# EasyEDA Pro project ProPrj_嵌赛国赛_2025-08-15.epro, schematic Schematic2

## Sheets
1 P1: Board Name: 药箱主控板; Create Date: 2025-07-22; Page Name: P1; Project Name: 嵌赛国赛; Schematic Name: Schematic2; Update Date: 2025-07-22; Company: 嘉立创EDA; Page Size: A4; Version: V1.0
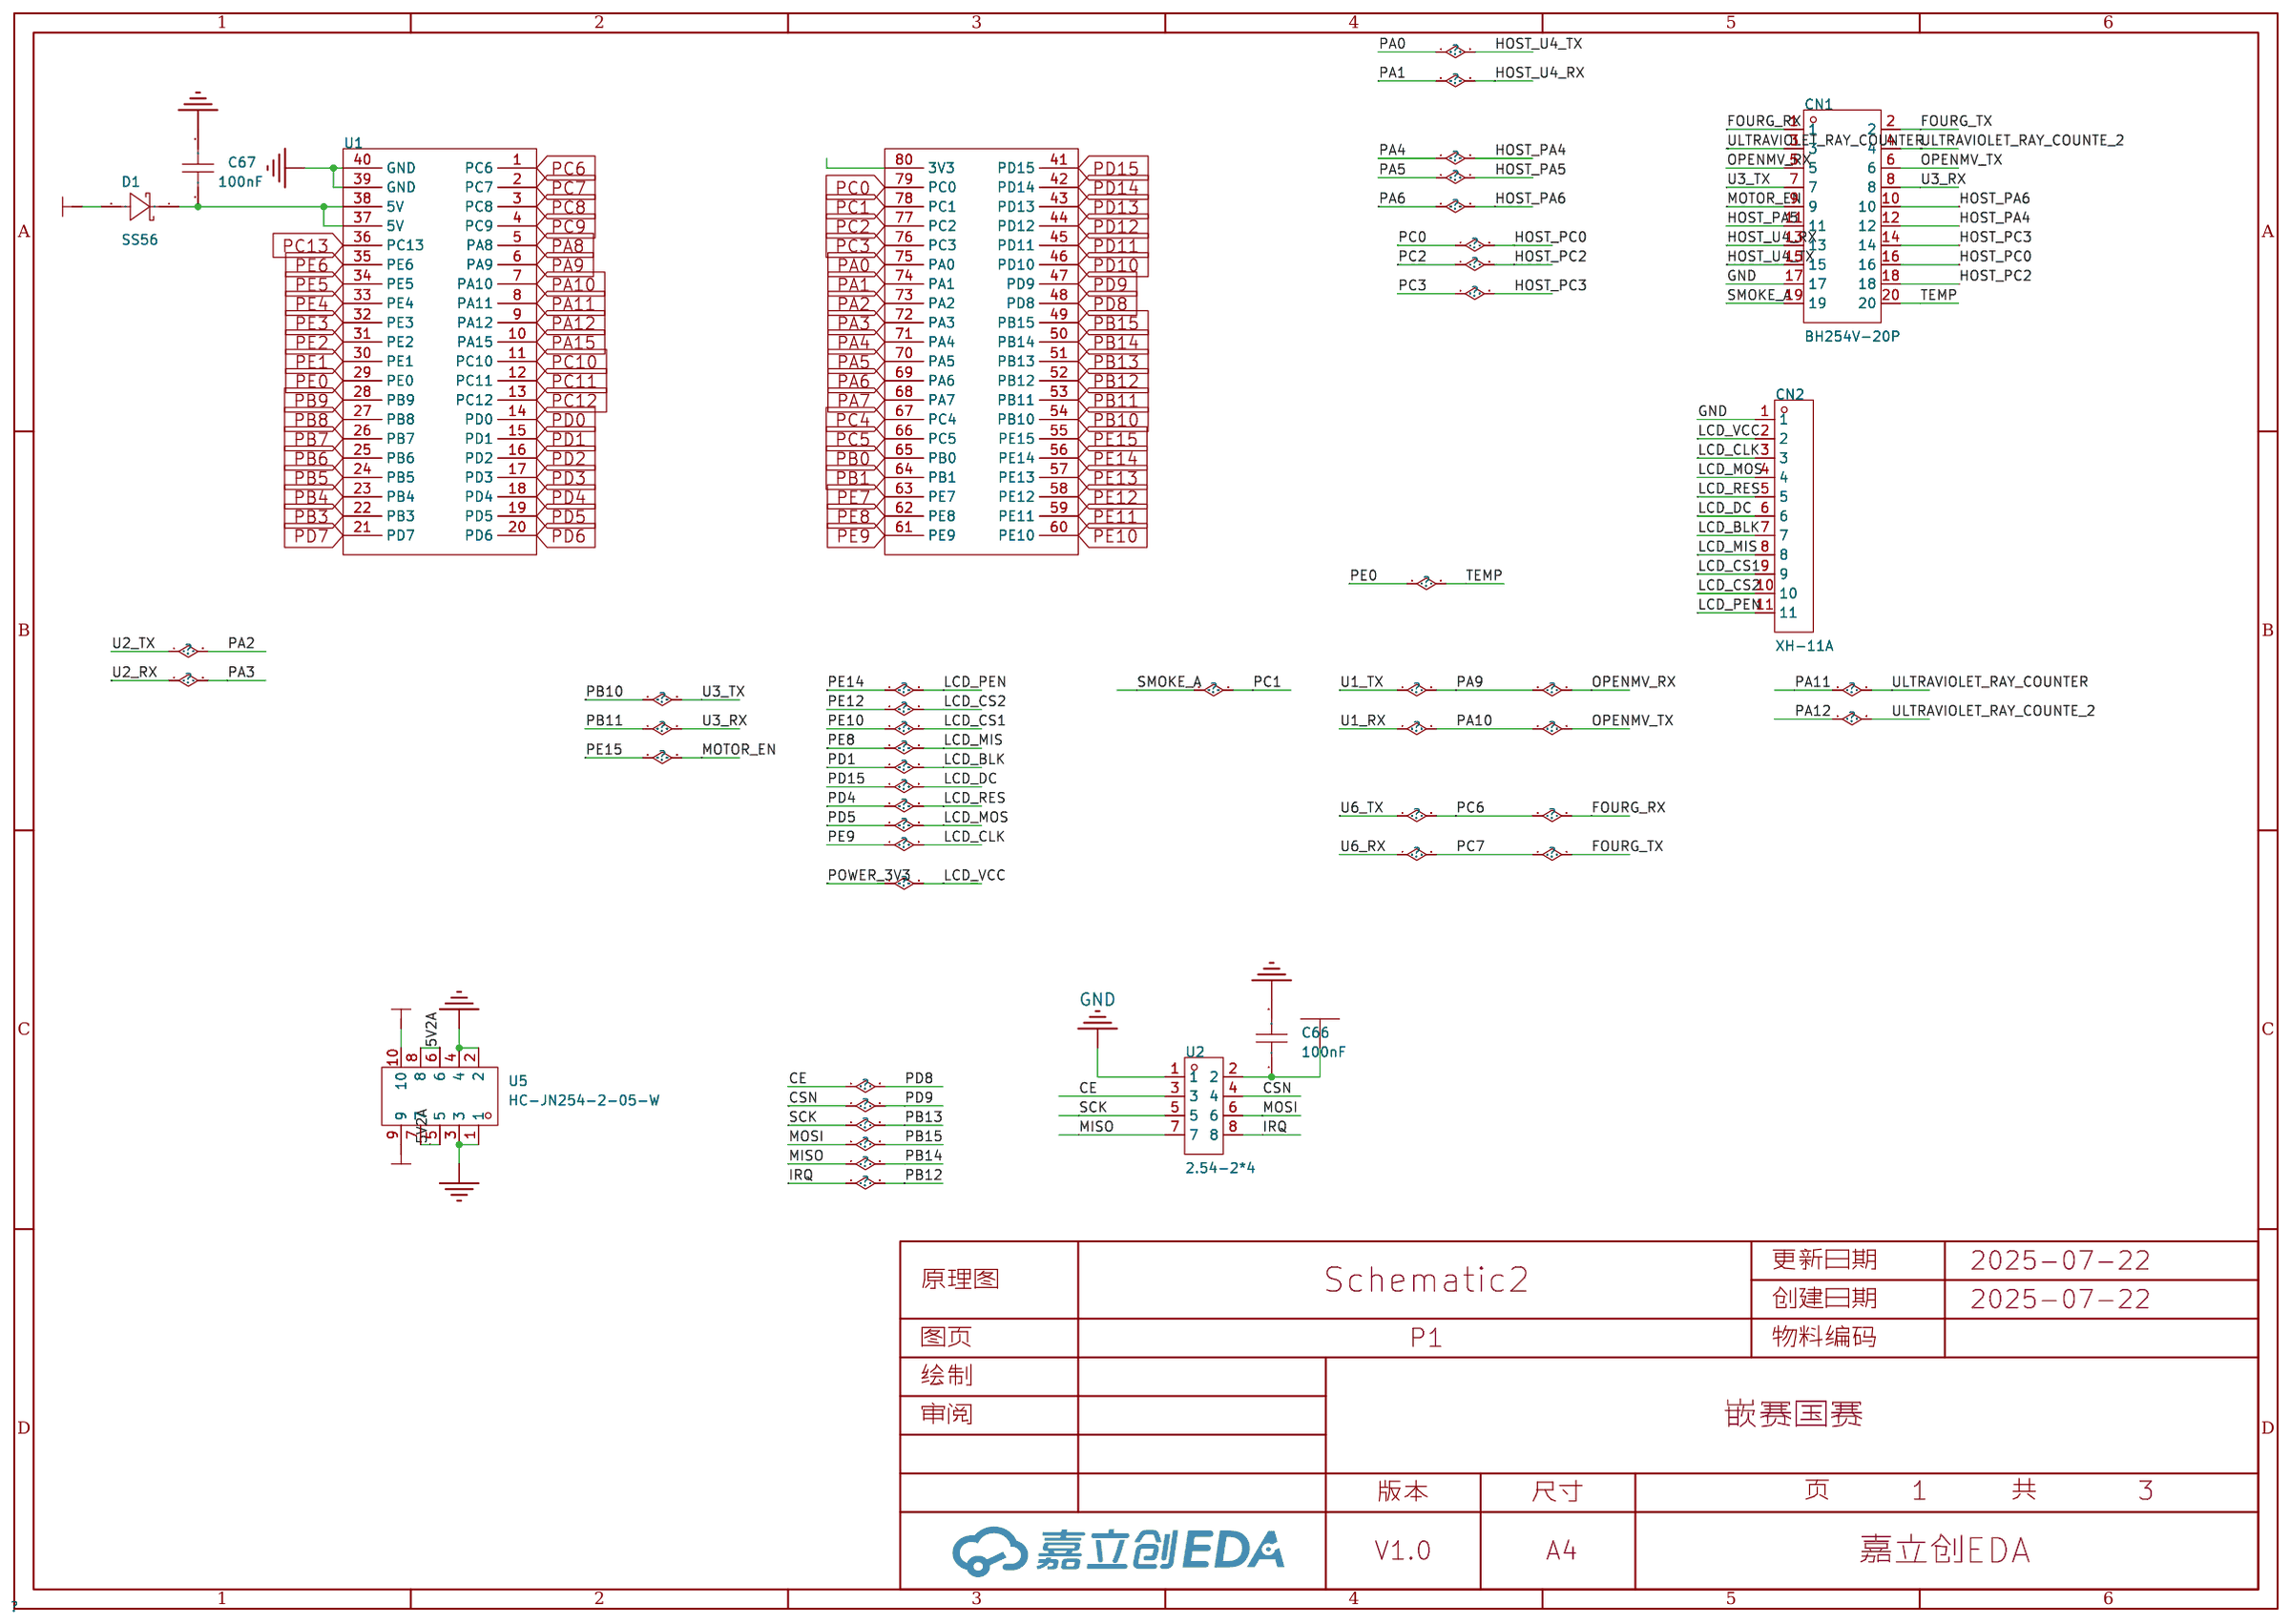
[diagram p8: P1]
2 P2: Create Date: 2025-06-21; Page Name: P2; Project Name: 嵌入式大赛; Update Date: 2025-06-21
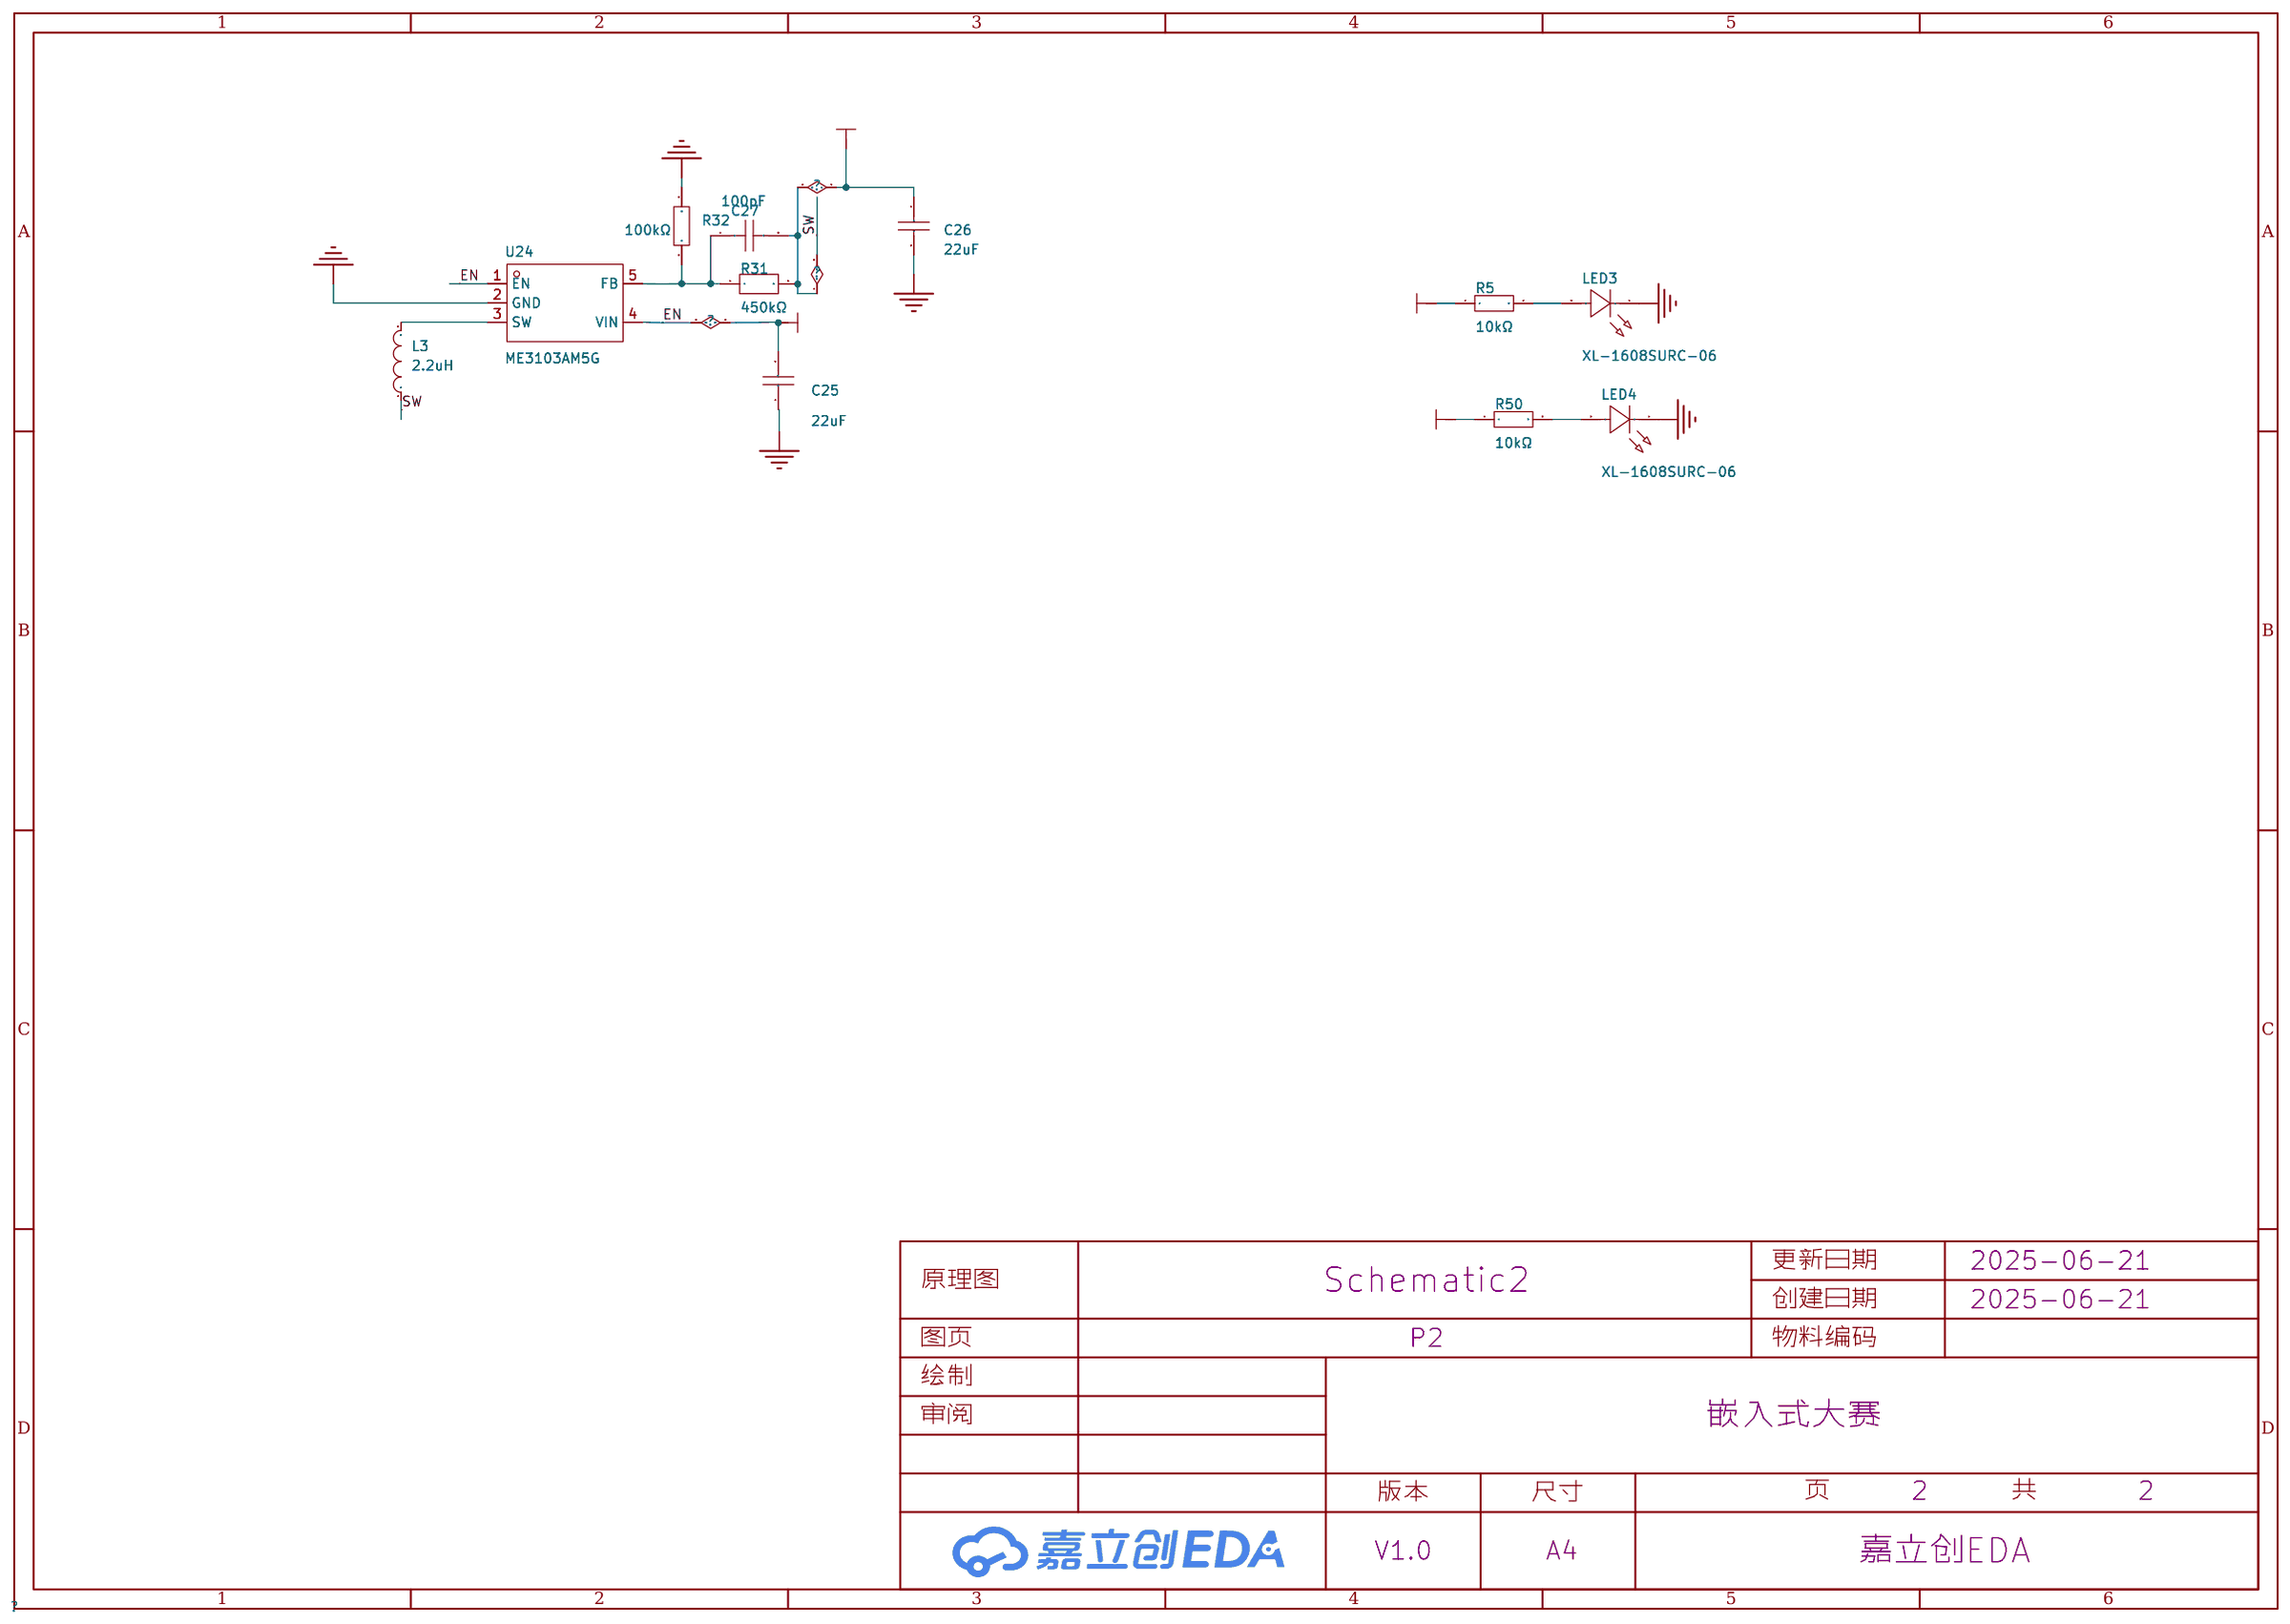
[diagram p9: P2]
3 P3: Page Name: P3
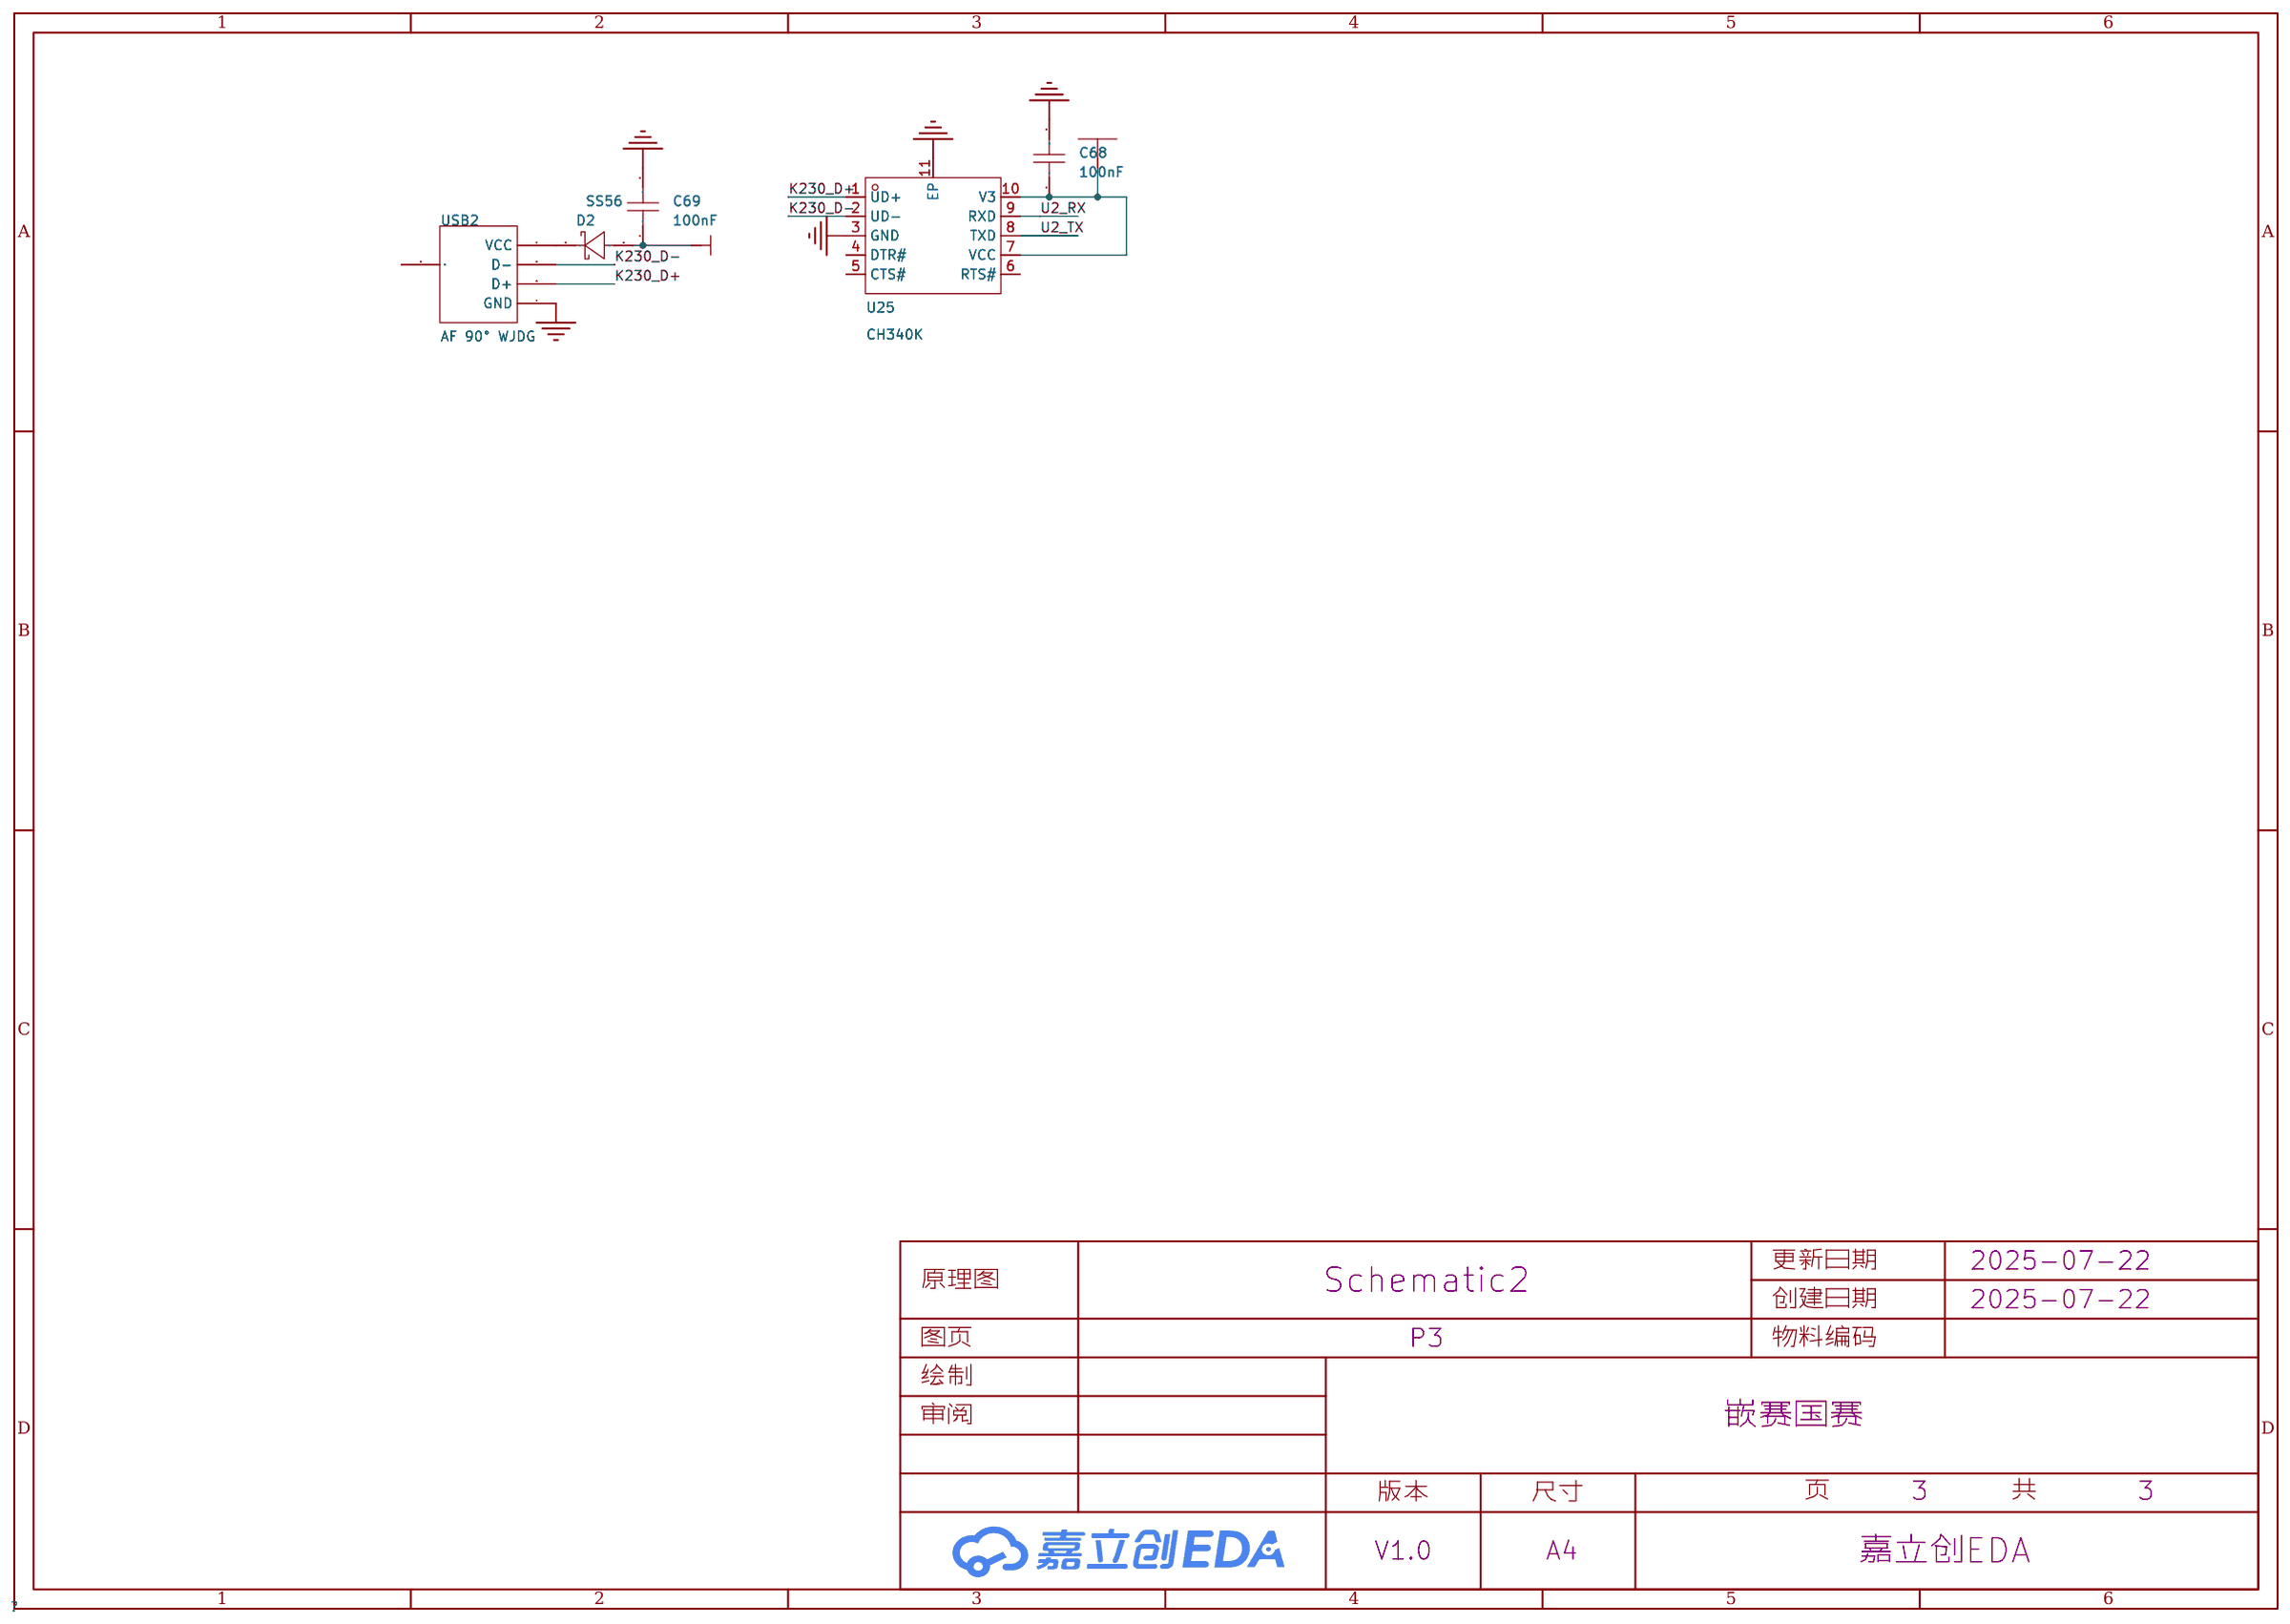
[diagram p10: P3]

## Parts
sheet P1
C66  100nF  [C0603]
C67  100nF  [C0603]
CN1  BH254V-20P  [CONN-TH_20P-P2.54_0702462001]
CN2  XH-11A  [CONN-TH_11P-P2.50_HCTL_XH-11A_C2908609]
D1  SS56  [SMA_L4.3-W2.6-LS5.0-RD]
U1  -  [stm32f103vet6系统板]
U2  2.54-2*4  [HDR-TH_8P-P2.54-V-F-R2-C4-S2.54]
U5  HC-JN254-2-05-W  [HDR-TH_10P-P2.54-H-F-R2-C5-W9.0]
sheet P2
C25  22uF  [C1206]
C26  22uF  [C1206]
C27  100pF  [C0603]
L3  2.2uH  [IND-SMD_L2.5-W2.0_MHCD252012A]
LED3  XL-1608SURC-06  [LED0603-RD_RED]
LED4  XL-1608SURC-06  [LED0603-RD_RED]
R5  10kΩ  [R0603]
R31  450kΩ  [R0402]
R32  100kΩ  [R0603]
R50  10kΩ  [R0603]
U24  ME3103AM5G  [SOT-23-5_L3.0-W1.7-P0.95-LS2.8-BR]
sheet P3
C68  100nF  [C0603]
C69  100nF  [C0603]
D2  SS56  [SMA_L4.3-W2.6-LS5.0-RD]
U25  CH340K  [ESOP-10_L4.9-W3.9-P1.00-LS6.2-BL-EP]
USB2  AF 90° WJDG  [USB-A-TH_AF-WJDG]

## Library data of the parts
C66-C69 = CC0603KRX7R9BB104: 容值:100nF;精度:±10%;额定电压:50V;材质(温度系数):X7R;; LCSC Part Name: 100nF ±10% 50V; Supplier Part: C14663; Manufacturer: YAGEO(国巨); Supplier Footprint: 0603; JLCPCB Part Class: Basic Part; Datasheet: https://atta.szlcsc.com/upload/public/pdf/source/20180910/C282072_33301C7F631E79921B82A8DAC6BCC5B3.pdf; Supplier: LCSC; Tolerance: ±10%; Voltage Rated: 50V; Temperature Coefficient: X7R
CN1 = BH254V-20P: 连接器类型:简牛座;间距:-;结构:2x10P;额定电流:3A;额定电压:250V;封装形式:直插;行距:2.54mm;排数:2;每排PIN数:10;触头材质:-;触头镀层:-;工作温度范围:-40℃~+105℃;焊接温度(最大值):-;; LCSC Part Name: 2x10P 排数:2 每排P数:10; Supplier Part: C492444; Manufacturer: XFCN(兴飞); Supplier Footprint: 插件,P=2.54mm; JLCPCB Part Class: 扩展库; Datasheet: https://atta.szlcsc.com/upload/public/pdf/source/20200312/C492444_4AABE2FC4F6BE8226B85135616AF0092.pdf; Supplier: LCSC; Connector Type: 简牛座; Structure: 2x10P; Current Rating (Max): 3A; Voltage Rating (Max): 250V; Holder Type: 直插; Row Spacing: 2.54mm; Number of Rows: 2; Pin Number in each Row: 10; Operating Temperature Range: -40℃~+105℃
CN2 = XH-11A_C2908609: 插针结构:1x11P;间距:2.5mm;安装方式:直插;参考系列:XH;总PIN数:11P;排数:1;每排PIN数:11;行距:-;额定电流:3A;触头材质:黄铜;触头镀层:锡;工作温度范围:-25℃~+85℃;; LCSC Part Name: 1x11P 间距:2.5mm 直插 系列:XH; Supplier Part: C2908609; Manufacturer: HCTL(华灿天禄); Supplier Footprint: 插件,P=2.5mm; JLCPCB Part Class: 扩展库; Datasheet: https://atta.szlcsc.com/upload/public/pdf/source/20230711/68D365716984B4AFE576D1D73D61B465.pdf; Supplier: LCSC; Pins Structure: 1x11P; Pitch: 2.5mm; Mounting Style: 直插; Reference Series: XH; Number of Pins: 11P; Number of Rows: 1; Number of PINs Per Row: 11; Current Rating (Max): 3A; Contact Material: 黄铜; Contact Plating: 锡; Operating Temperature Range: -25℃~+85℃
D1 D2 = SS56_C18199169: 二极管配置:独立式;正向压降(Vf):700mV@5.0A;直流反向耐压(Vr):60V;整流电流:5A;; LCSC Part Name: 电压:60V 电流:5A; Supplier Part: C18199169; Manufacturer: 宏迦橙; Supplier Footprint: SMA(DO-214AC); JLCPCB Part Class: 扩展库; Datasheet: https://atta.szlcsc.com/upload/public/pdf/source/20230828/254C3882F8647358AD9F60DD73611B5E.pdf; Supplier: LCSC; Diode Configuration: 独立式; Forward Voltage (Vf@If): 700mV@5.0A; Reverse Voltage (Vr): 60V; Rectified Current: 5A; Reverse Leakage Current (Ir): 200uA@60V
U1 = STM32F103VET6系统板
U2 = 2.54-2*4: 插孔结构:2x4P;间距:2.54mm;行距:2.54mm;圆孔/方孔:方孔;安装类型:直插;排数:双排;总孔位数:8P;额定电流:2.5A;额定电压:-;插孔方向:顶部;塑高:8.5mm;工作温度范围:-40℃~+105℃;; LCSC Part Name: 间距:2.54mm 2x4P 直插; Supplier Part: C2977588; Manufacturer: ZHOURI(洲日); Supplier Footprint: 插件,P=2.54mm; JLCPCB Part Class: 扩展库; Datasheet: https://atta.szlcsc.com/upload/public/pdf/source/20220328/363EB391BC0EB759CF231FC910753CBE.pdf; Supplier: LCSC; Holes Structure: 2x4P; Pitch: 2.54mm; Row Spacing: 2.54mm; Circular Hole / Square Hole: 方孔; Mounting Type: 直插; Number of Rows: 双排; Number of Holes: 8P; Current Rating (Max): 2.5A; Holes Direction: 顶部; Insulation Height: 8.5mm; Operating Temperature Range: -40℃~+105℃
U5 = HC-JN254-2-05-W: 连接器类型:简牛座;间距:2.54mm;结构:2x5P;额定电流:3A;额定电压:-;封装形式:弯插;行距:2.54mm;排数:2;每排PIN数:5;触头材质:黄铜;触头镀层:金;工作温度范围:-40℃~+105℃;焊接温度(最大值):260℃@10S;; LCSC Part Name: 2.54mm 2x5P 排数:2 每排P数:5; Supplier Part: C5372873; Manufacturer: HCTL(华灿天禄); Supplier Footprint: 弯插,P=2.54mm; JLCPCB Part Class: 扩展库; Datasheet: https://atta.szlcsc.com/upload/public/pdf/source/20230314/29278A24539954283B80828B9C32CD4C.pdf; Supplier: LCSC; Connector Type: 简牛座; Pitch: 2.54mm; Structure: 2x5P; Current Rating (Max): 3A; Holder Type: 弯插; Row Spacing: 2.54mm; Number of Rows: 2; Pin Number in each Row: 5; Contact Material: 黄铜; Contact Plating: 金; Operating Temperature Range: -40℃~+105℃; Soldering Temperature(Max): 260℃@10S
C25 C26 = CL31A226KAHNNNE: 容值:22uF;精度:±10%;额定电压:25V;材质(温度系数):X5R;; LCSC Part Name: 22uF ±10% 25V; Supplier Part: C12891; Manufacturer: SAMSUNG(三星); Supplier Footprint: 1206; JLCPCB Part Class: 基础库; Datasheet: https://atta.szlcsc.com/upload/public/pdf/source/20160218/1457707763339.pdf; Supplier: LCSC; Tolerance: ±10%; Voltage Rated: 25V; Temperature Coefficient: X5R
C27 = CC0603JRNPO9BN101: 容值:100pF;精度:±5%;额定电压:50V;材质(温度系数):NP0;; LCSC Part Name: 100pF ±5% 50V; Supplier Part: C14665; Manufacturer: YAGEO(国巨); Supplier Footprint: 0603; JLCPCB Part Class: 扩展库; Datasheet: https://atta.szlcsc.com/upload/public/pdf/source/20181008/C309499_21CC21451B82C39E3D92150FD6B30293.pdf; Supplier: LCSC; Tolerance: ±5%; Voltage Rated: 50V; Temperature Coefficient: NP0
L3 = BDCD002520102R2MS1: 电感值:2.2uH;精度:±20%;额定电流:1.4A;饱和电流(Isat):2.6A;; LCSC Part Name: 2.2uH ±20% 2.6A; Supplier Part: C2838385; Manufacturer: chilisin(奇力新); Supplier Footprint: 1008; JLCPCB Part Class: 扩展库; Datasheet: https://atta.szlcsc.com/upload/public/pdf/source/20210908/A593167DE07B217A909851FD79DFB804.pdf; Supplier: LCSC; Tolerance: ±20%; Rated Current: 1.4A; Saturation Current (Isat): 2.6A; DC Resistance (DCR): 130mΩ
LED3 LED4 = XL-1608SURC-06: 发光颜色:红色;功率:55mW;正向电流:25mA;主波长:617nm~621nm;透镜颜色:无色透明透镜;色温:-;发光角度:120°;载带方式:正贴;工作温度:-30℃~+85℃;; Supplier Part: C965799; Manufacturer: XINGLIGHT(成兴光); Supplier Footprint: 0603; JLCPCB Part Class: 扩展库; Datasheet: https://atta.szlcsc.com/upload/public/pdf/source/20221102/D860AFDD1CDB02C5A8064103A32707E2.pdf; Supplier: LCSC; Emitted Color: 红色; Power Dissipation: 55mW; Forward Current: 25mA; Dominant Wavelength: 617nm~621nm; Peak Wavelength: 623nm; Lens Color: 无色透明透镜; Viewing Angle: 120°; Mounting Sytle: 正贴; Operating Temperature: -30℃~+85℃
R5 R50 = 0603WAF1002T5E: 电阻类型:厚膜电阻;阻值:10kΩ;精度:±1%;功率:100mW;最大工作电压:75V;温度系数:±100ppm/℃;; LCSC Part Name: 厚膜电阻 10kΩ ±1% 100mW; Supplier Part: C25804; Manufacturer: UNI-ROYAL(厚声); Supplier Footprint: 0603; JLCPCB Part Class: Basic Part; Datasheet: https://atta.szlcsc.com/upload/public/pdf/source/20200306/C422600_1E6D84923E4A46A82E41ADD87F860B5C.pdf; Supplier: LCSC; Type: 厚膜电阻; Tolerance: ±1%; Power(Watts): 100mW; Overload Voltage (Max): 75V; Temperature Coefficient: ±100ppm/℃; Operating Temperature Range: -55℃~+155℃
R31 = FRC0402F4503TS: 电阻类型:厚膜电阻;阻值:450kΩ;精度:±1%;功率:62.5mW;最大工作电压:50V;温度系数:±100ppm/℃;; LCSC Part Name: 450kΩ ±1% 62.5mW 厚膜电阻; Supplier Part: C5159688; Manufacturer: FOJAN(富捷); Supplier Footprint: 0402; JLCPCB Part Class: 扩展库; Datasheet: https://atta.szlcsc.com/upload/public/pdf/source/20211221/925EC7D7225764EE0046F22065062C87.pdf; Supplier: LCSC; Type: 厚膜电阻; Tolerance: ±1%; Power(Watts): 62.5mW; Overload Voltage (Max): 50V; Temperature Coefficient: ±100ppm/℃
R32 = 0603WAF1003T5E: 电阻类型:厚膜电阻;阻值:100kΩ;精度:±1%;功率:100mW;最大工作电压:75V;温度系数:±100ppm/℃;; LCSC Part Name: 100kΩ ±1% 100mW 厚膜电阻; Supplier Part: C25803; Manufacturer: UNI-ROYAL(厚声); Supplier Footprint: 0603; JLCPCB Part Class: 基础库; Datasheet: https://atta.szlcsc.com/upload/public/pdf/source/20200306/C422600_1E6D84923E4A46A82E41ADD87F860B5C.pdf; Supplier: LCSC; Type: 厚膜电阻; Tolerance: ±1%; Power(Watts): 100mW; Overload Voltage (Max): 75V; Temperature Coefficient: ±100ppm/℃; Operating Temperature Range: -55℃~+155℃
U24 = ME3103AM5G: 功能类型:降压型;输入电压:2.5V~5.5V;输出电压:600mV~5.5V;输出电流(最大值):1A;; Supplier Part: C236734; Manufacturer: MICRONE(南京微盟); Supplier Footprint: SOT-23-5; JLCPCB Part Class: 扩展库; Datasheet: https://atta.szlcsc.com/upload/public/pdf/source/20180709/C236734_1C8BBF9BA334136D9FAF85020467E81B.pdf; Supplier: LCSC; Function: 降压型; Input Voltage: 2.5V~5.5V; Output Voltage: 600mV~5.5V; Output Current (Max): 1A; Switching Frequency: 1.5MHz; Synchronous Rectification: 是; Number of Outputs: 1; Topology: 降压式; Switch tube (built-in/external): 内置
U25 = CH340K: 应用功能:USB转串口;接口协议:USB 2.0;通道数:-;数据速率:2Mbps;; LCSC Part Name: USB转串口芯片CH340; Supplier Part: C968586; Manufacturer: WCH(南京沁恒); Supplier Footprint: ESSOP-10-150mil-1mm; JLCPCB Part Class: 扩展库; Datasheet: https://atta.szlcsc.com/upload/public/pdf/source/20240313/C21A12AB66F63ABF8F8743FF13A35C95.pdf; Supplier: LCSC; Applications Function: USB转串口; Protocol: USB 2.0; Voltage - Supply: 3.3V；5V; Data Rate: 2Mbps; Operating Temperature: -20℃~+70℃
USB2 = AF 90° WJDG: 连接器类型:Type-A;标准:USB 2.0;公母:母;安装方式:弯插;触点数量:4P;端口数量:1;额定电流 - 电源:1.5A;工作温度范围:-25℃~+85℃;; LCSC Part Name: Type-A 母 弯插; Supplier Part: C456018; Manufacturer: SHOU HAN(首韩); Supplier Footprint: 插件; JLCPCB Part Class: 扩展库; Datasheet: https://atta.szlcsc.com/upload/public/pdf/source/20241125/1CC41152EE29FFE03A5868591A920D3B.pdf; Supplier: LCSC; Connector Type: Type-A; Standard: USB 2.0; Gender: 母; Mounting Style: 弯插; Number of Contacts: 4P; Number of Ports: 1; Current Rating - Power (Max): 1.5A; Rated Voltage (Max): 30V; Connect-Disconnect Life: 5千次; Length: 14mm; Core Colour: 白色; Operating Temperature Range: -25℃~+85℃

## Nets
5V2A: C25.2 D1.2(A) R50.1 U5.5 U5.6 U5.7 U5.8 U24.1(EN) U24.4(VIN)
5V2AESP32: C69.1 D2.2(A) U5.9 U5.10
GND: C25.1 C26.2 C66.2 C67.2 C68.2 C69.2 CN1.17 CN2.1 LED3.1(K) LED4.1(K) R32.2 U1.39(GND) U1.40(GND) U2.1 U5.1 U5.2 U5.3 U5.4 U24.2(GND) U25.3(GND) U25.11(EP) USB2.4(GND)
CE: U1.48(PD8) U2.3
CSN: U1.47(PD9) U2.4
FOURG_RX: CN1.1 U1.1(PC6)
FOURG_TX: CN1.2 U1.2(PC7)
HOST_PA4: CN1.12 U1.71(PA4)
HOST_PA5: CN1.11 U1.70(PA5)
HOST_PA6: CN1.10 U1.69(PA6)
HOST_PC0: CN1.16 U1.79(PC0)
HOST_PC2: CN1.18 U1.77(PC2)
HOST_PC3: CN1.14 U1.76(PC3)
HOST_U4_RX: CN1.13 U1.74(PA1)
HOST_U4_TX: CN1.15 U1.75(PA0)
IRQ: U1.52(PB12) U2.8
K230_D+: U25.1(UD+) USB2.3(D+)
K230_D-: U25.2(UD-) USB2.2(D-)
LCD_BLK: CN2.7 U1.15(PD1)
LCD_CLK: CN2.3 U1.61(PE9)
LCD_CS1: CN2.9 U1.60(PE10)
LCD_CS2: CN2.10 U1.58(PE12)
LCD_DC: CN2.6 U1.41(PD15)
LCD_MIS: CN2.8 U1.62(PE8)
LCD_MOS: CN2.4 U1.19(PD5)
LCD_PEN: CN2.11 U1.56(PE14)
LCD_RES: CN2.5 U1.18(PD4)
MISO: U1.50(PB14) U2.7
MOSI: U1.49(PB15) U2.6
MOTOR_EN: CN1.9 U1.55(PE15)
OPENMV_RX: CN1.5 U1.6(PA9)
OPENMV_TX: CN1.6 U1.7(PA10)
PA2: U1.73(PA2) U25.8(TXD)
PA3: U1.72(PA3) U25.9(RXD)
PA7: U1.68(PA7)
PA8: U1.5(PA8)
PA11: CN1.3 U1.8(PA11)
PA12: CN1.4 U1.9(PA12)
PA15: U1.10(PA15)
PB0: U1.65(PB0)
PB1: U1.64(PB1)
PB3: U1.22(PB3)
PB4: U1.23(PB4)
PB5: U1.24(PB5)
PB6: U1.25(PB6)
PB7: U1.26(PB7)
PB8: U1.27(PB8)
PB9: U1.28(PB9)
PB10: CN1.7 U1.54(PB10)
PB11: CN1.8 U1.53(PB11)
PB13: U1.51(PB13) U2.5
PC1: CN1.19 U1.78(PC1)
PC4: U1.67(PC4)
PC5: U1.66(PC5)
PC8: U1.3(PC8)
PC9: U1.4(PC9)
PC10: U1.11(PC10)
PC11: U1.12(PC11)
PC12: U1.13(PC12)
PC13: U1.36(PC13)
PD0: U1.14(PD0)
PD2: U1.16(PD2)
PD3: U1.17(PD3)
PD6: U1.20(PD6)
PD7: U1.21(PD7)
PD10: U1.46(PD10)
PD11: U1.45(PD11)
PD12: U1.44(PD12)
PD13: U1.43(PD13)
PD14: U1.42(PD14)
PE0: CN1.20 U1.29(PE0)
PE1: U1.30(PE1)
PE2: U1.31(PE2)
PE3: U1.32(PE3)
PE4: U1.33(PE4)
PE5: U1.34(PE5)
PE6: U1.35(PE6)
PE7: U1.63(PE7)
PE11: U1.59(PE11)
PE13: U1.57(PE13)
POWER_3V3: C26.1 C27.2 C66.1 C68.1 CN2.2 L3.1 R5.1 R31.2 U2.2 U25.7(VCC) U25.10(V3)
$1N6630: C67.1 D1.1(K) U1.37(5V) U1.38(5V)
$2N911: LED3.2(A) R5.2
$2N914: LED4.2(A) R50.2
$3N979: D2.1(K) USB2.1(VCC)
Net-(C27-1): C27.1 R32.1 U24.5(FB)

Not connected (* = marked no-connect by the designer): L3 2; R31 1; U1 80(3V3); U24 3(SW); U25 4(DTR#) 5(CTS#) 6(RTS#); USB2 5(SHLD)
